# Altium schematic sheet power_part.SchDoc
size A; SheetNumber: 3; SheetTotal: 4
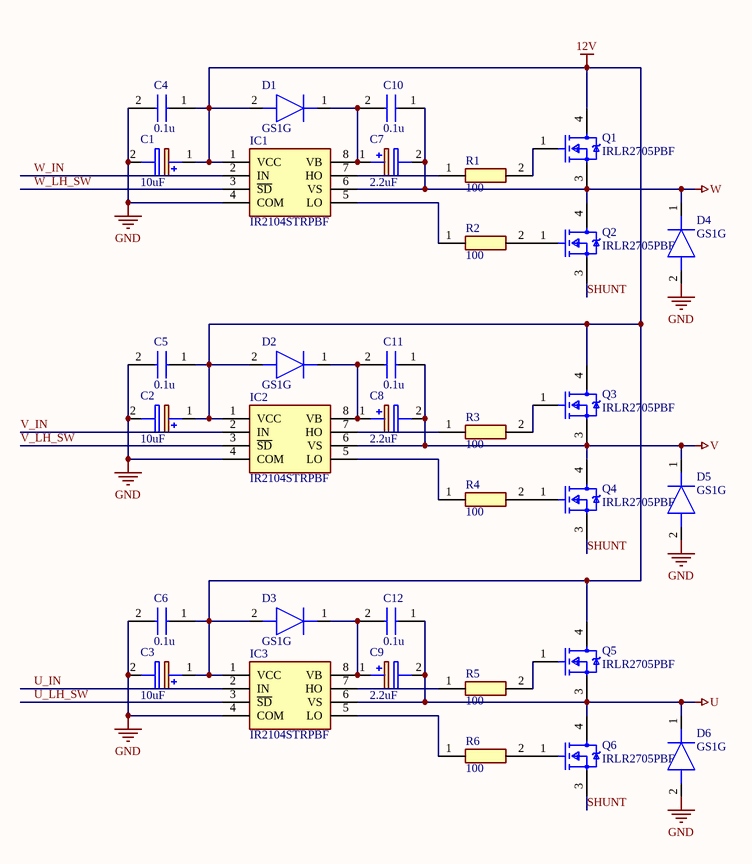
[diagram p0: power_part.SchDoc]

## Parts
C1  10uF  [EEE1AA220WR]
C2  10uF  [EEE1AA220WR]
C3  10uF  [EEE1AA220WR]
C4  0.1u  [CAPC2012X95N]
C5  0.1u  [CAPC2012X95N]
C6  0.1u  [CAPC2012X95N]
C7  2.2uF  [EEE1AA220WR]
C8  2.2uF  [EEE1AA220WR]
C9  2.2uF  [EEE1AA220WR]
C10  0.1u  [CAPC2012X95N]
C11  0.1u  [CAPC2012X95N]
C12  0.1u  [CAPC2012X95N]
D1  GS1G  [DIOM5027X244N]
D2  GS1G  [DIOM5027X244N]
D3  GS1G  [DIOM5027X244N]
D4  GS1G  [DIOM5027X244N]
D5  GS1G  [DIOM5027X244N]
D6  GS1G  [DIOM5027X244N]
IC1  IR2104STRPBF  [SOIC127P600X175-8N]
IC2  IR2104STRPBF  [SOIC127P600X175-8N]
IC3  IR2104STRPBF  [SOIC127P600X175-8N]
Q1  IRLR2705PBF  [FP-PG-TO252-3-MFG]
Q2  IRLR2705PBF  [FP-PG-TO252-3-MFG]
Q3  IRLR2705PBF  [FP-PG-TO252-3-MFG]
Q4  IRLR2705PBF  [FP-PG-TO252-3-MFG]
Q5  IRLR2705PBF  [FP-PG-TO252-3-MFG]
Q6  IRLR2705PBF  [FP-PG-TO252-3-MFG]
R1  100  [RESC2012X60N]
R2  100  [RESC2012X60N]
R3  100  [RESC2012X60N]
R4  100  [RESC2012X60N]
R5  100  [RESC2012X60N]
R6  100  [RESC2012X60N]

## Nets
12V: C1.1(+) C2.1(+) C3.1(+) C4.1 C5.1 C6.1 D1.2(A) D2.2(A) D3.2(A) IC1.1(VCC) IC2.1(VCC) IC3.1(VCC) Q1.4(D) Q3.4(D) Q5.4(D)
GND: C1.2(-) C2.2(-) C3.2(-) C4.2 C5.2 C6.2 D4.2(A) D5.2(A) D6.2(A) IC1.4(COM) IC2.4(COM) IC3.4(COM)
U: C9.2(-) C12.1 D6.1(K) IC3.6(VS) Q5.3(S) Q6.4(D)
V: C8.2(-) C11.1 D5.1(K) IC2.6(VS) Q3.3(S) Q4.4(D)
W: C7.2(-) C10.1 D4.1(K) IC1.6(VS) Q1.3(S) Q2.4(D)
SHUNT: Q2.3(S) Q4.3(S) Q6.3(S)
U_IN: IC3.2(IN)
U_LH_SW: IC3.3(~{SD})
V_IN: IC2.2(IN)
V_LH_SW: IC2.3(~{SD})
W_IN: IC1.2(IN)
W_LH_SW: IC1.3(~{SD})
NetC7_1: C7.1(+) C10.2 D1.1(K) IC1.8(VB)
NetC8_1: C8.1(+) C11.2 D2.1(K) IC2.8(VB)
NetC9_1: C9.1(+) C12.2 D3.1(K) IC3.8(VB)
NetIC1_5: IC1.5(LO) R2.1
NetIC1_7: IC1.7(HO) R1.1
NetIC2_5: IC2.5(LO) R4.1
NetIC2_7: IC2.7(HO) R3.1
NetIC3_5: IC3.5(LO) R6.1
NetIC3_7: IC3.7(HO) R5.1
NetQ1_1: Q1.1(G) R1.2
NetQ2_1: Q2.1(G) R2.2
NetQ3_1: Q3.1(G) R3.2
NetQ4_1: Q4.1(G) R4.2
NetQ5_1: Q5.1(G) R5.2
NetQ6_1: Q6.1(G) R6.2

## Library data of the parts
C1-C3 = EEE-FK1E100R: Capacitor Polarised; Manufacturer_Name: Panasonic; Datasheet Link: http://industrial.panasonic.com/cdbs/www-data/pdf/RDE0000/ABA0000C1181.pdf; Height: 5.5mm; Manufacturer_Part_Number: EEE-FK1E100R; Mouser Part Number: 667-EEE-FK1E100R; Mouser Price/Stock: https://www.mouser.co.uk/ProductDetail/Panasonic/EEE-FK1E100R?qs=qE6bgDGEOCuIB5AxqKF88Q%3D%3D; Arrow Part Number: EEE-FK1E100R; Arrow Price/Stock: https://www.arrow.com/en/products/eeefk1e100r/panasonic?region=nac
C4-C6 C10-C12 = GRM219F51H104ZA01B: Capacitor; Manufacturer_Name: Murata Electronics; Datasheet Link: http://www.murata.com/~/media/webrenewal/support/library/catalog/products/capacitor/mlcc/c02e.pdf; Height: 0.95mm; Manufacturer_Part_Number: GRM219F51H104ZA01B; Mouser Part Number: 81-GRM21F51H104ZA01B; Mouser Price/Stock: https://www.mouser.co.uk/ProductDetail/Murata-Electronics/GRM219F51H104ZA01B?qs=A13M%252BoT%252Bkzo6MjTOB8REcg%3D%3D
C7-C9 = EEE-HB1H2R2AR: Capacitor Polarised; Manufacturer_Name: Panasonic; Datasheet Link: http://industrial.panasonic.com/cdbs/www-data/pdf/RDE0000/ABA0000C1154.pdf; Height: 5.5mm; Manufacturer_Part_Number: EEE-HB1H2R2AR; Mouser Part Number: 667-EEE-HB1H2R2AR; Mouser Price/Stock: https://www.mouser.co.uk/ProductDetail/Panasonic/EEE-HB1H2R2AR?qs=d1CqaRUMZD8bJW987Ww1zg%3D%3D; Arrow Part Number: EEE-HB1H2R2AR; Arrow Price/Stock: https://www.arrow.com/en/products/eee-hb1h2r2ar/panasonic
D1-D6 = GS1G: Diode; Manufacturer_Name: PANJIT International Inc; Datasheet Link: https://www.panjit.com.tw/en/Product/downloadPDF/GS1G; Height: 2.44mm; Manufacturer_Part_Number: GS1G
IC1-IC3 = IR2104STRPBF: Integrated Circuit; Manufacturer_Name: Infineon; Datasheet Link: https://www.infineon.com/cms/en/product/power/gate-driver-ics/?; Height: 1.75mm; Manufacturer_Part_Number: IR2104STRPBF; Mouser Part Number: 942-IR2104STRPBF; Mouser Price/Stock: https://www.mouser.co.uk/ProductDetail/Infineon-Technologies/IR2104STRPBF?qs=2r01AXMCG3NCbspWVHqTYw%3D%3D; Arrow Part Number: IR2104STRPBF; Arrow Price/Stock: https://www.arrow.com/en/products/ir2104strpbf/infineon-technologies-ag?region=nac
Q1-Q6 = CMP-32901-000108-1: MOSFET N-CH 55V 44A DPAK; Manufacturer: Infineon; Manufacturer Part Number: IRFR1205TRPBF; Input Capacitace At Vds: 1300pF @ 25V; Depletion Mode: False; Pulse Drain Current: 160A; Gate Charge At Vgs: 65nC @ 10V; Gate To Source Voltage: 20V; Turn On Delay Time: 7.3ns; Number Of Channels: 1; Transconductance: 17S; Reverse Recovery Time: 65ns; Threshold Vgs Max: 4V; Turn Off Delay Time: 47ns; Threshold Vgs Min: 2V; Reverse Recovery Charge: 160nC; Rthja Max: 50°C/W; Drain To Source Resistance: 0.027Ω; Max Junction Temp: +175°C; Max Forward Diode Voltage: 1.3V; Power Dissipation: 107W; RoHS: TRUE; Category: Trans; Height: 2.52mm; Drain To Source Voltage: 55V; Device Class L1: Discrete Semiconductors; Octopart: https://octopart.com/irfr1205trpbf-infineon-65874068; Drain To Source Breakdown Voltage: 55V; Number Of N Channels: 1; ComponentLink2URL: https://www.infineon.com/dgdl/irfr1205pbf.pdf?fileId=5546d462533600a40153562d17792047; Temperature Range Low: -55°C; Temperature: -55°C to +175°C; Digikey Description: MOSFET N-CH 55V 44A DPAK; Device Class L2: Transistors; Temperature Range High: +175°C; Package: PG-TO252-3; Automotive: No; Continuous Drain Current: 44A; Device Class L3: MOSFETs; ComponentLink2Description: Datasheet; Footprint Url: https://www.infineon.com/cms/en/product/packages/PG-TO252/PG-TO252-3-901/; Lead Free: Yes
R1-R6 = RC0805JR-0720RL: Resistor; Manufacturer_Name: KEMET; Datasheet Link: http://www.yageo.com/documents/recent/PYu-RC_Group_51_RoHS_L_10.pdf; Height: 0.6mm; Manufacturer_Part_Number: RC0805JR-0720RL; Mouser Part Number: 603-RC0805JR-0720RL; Mouser Price/Stock: https://www.mouser.com/Search/Refine.aspx?Keyword=603-RC0805JR-0720RL; Arrow Part Number: RC0805JR-0720RL; Arrow Price/Stock: https://www.arrow.com/en/products/rc0805jr-0720rl/yageo